# EAGLE design ps3-teensy-hid-v11 (EAGLE 5.09)
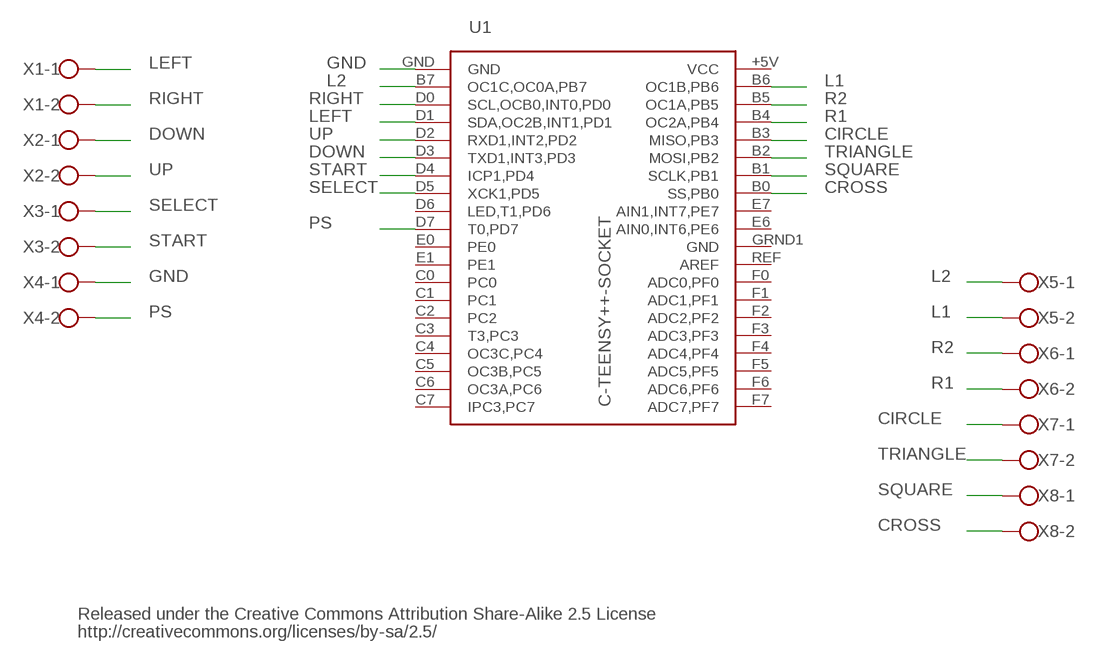
[diagram p0: schematic, sheet 1]

## Parts
U1  C-TEENSY++-SOCKET  [TEENSY++SOCKET]
X1  W237-102  [W237-102]
X2  W237-102  [W237-102]
X3  W237-102  [W237-102]
X4  W237-102  [W237-102]
X5  W237-102  [W237-102]
X6  W237-102  [W237-102]
X7  W237-102  [W237-102]
X8  W237-102  [W237-102]

## Nets
CIRCLE: U1.B3(MISO,PB3) X7.1
CROSS: U1.B0(SS,PB0) X8.2
DOWN: U1.D3(TXD1,INT3,PD3) X2.1
GND: U1.GND X4.1
L1: U1.B6(OC1B,PB6) X5.2
L2: U1.B7(OC1C,OC0A,PB7) X5.1
LEFT: U1.D1(SDA,OC2B,INT1,PD1) X1.1
PS: U1.D7(T0,PD7) X4.2
R1: U1.B4(OC2A,PB4) X6.2
R2: U1.B5(OC1A,PB5) X6.1
RIGHT: U1.D0(SCL,OCB0,INT0,PD0) X1.2
SELECT: U1.D5(XCK1,PD5) X3.1
SQUARE: U1.B1(SCLK,PB1) X8.1
START: U1.D4(ICP1,PD4) X3.2
TRIANGLE: U1.B2(MOSI,PB2) X7.2
UP: U1.D2(RXD1,INT2,PD2) X2.2
Unconnected: U1.C0 U1.C1 U1.C2 U1.C3(T3,PC3) U1.C4(OC3C,PC4) U1.C5(OC3B,PC5) U1.C6(OC3A,PC6) U1.C7(IPC3,PC7) U1.D6(LED,T1,PD6) U1.E0 U1.E1 U1.E6(AIN0,INT6,PE6) U1.E7(AIN1,INT7,PE7) U1.F0(ADC0,PF0) U1.F1(ADC1,PF1) U1.F2(ADC2,PF2) U1.F3(ADC3,PF3) U1.F4(ADC4,PF4) U1.F5(ADC5,PF5) U1.F6(ADC6,PF6) U1.F7(ADC7,PF7) U1.REF(AREF)

## Notes on the sheet
- Released under the Creative Commons Attribution Share-Alike 2.5 License
- http://creativecommons.org/licenses/by-sa/2.5/

## Power pins joined to a net without a drawn wire
GND: U1.GRND1(GND)
VCC: U1.+5V(VCC)

## Library data of the parts
U1 = teensypp:C-TEENSY++-SOCKET
X1-X8 = con-wago-500:W237-102: WAGO SCREW CLAMP

## Board
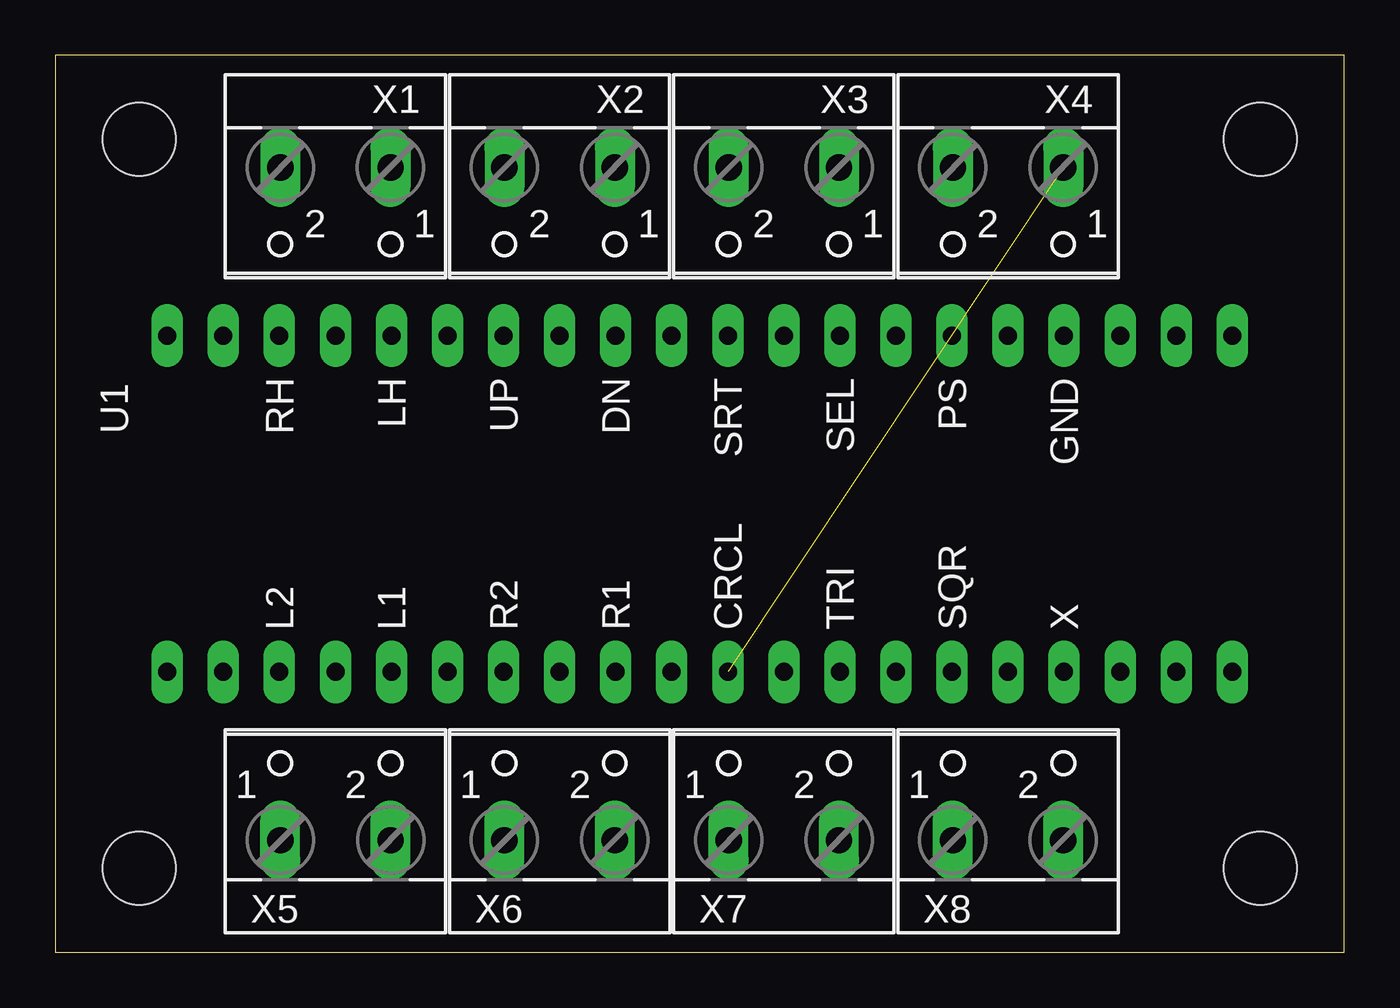
[diagram p1: board, top side]
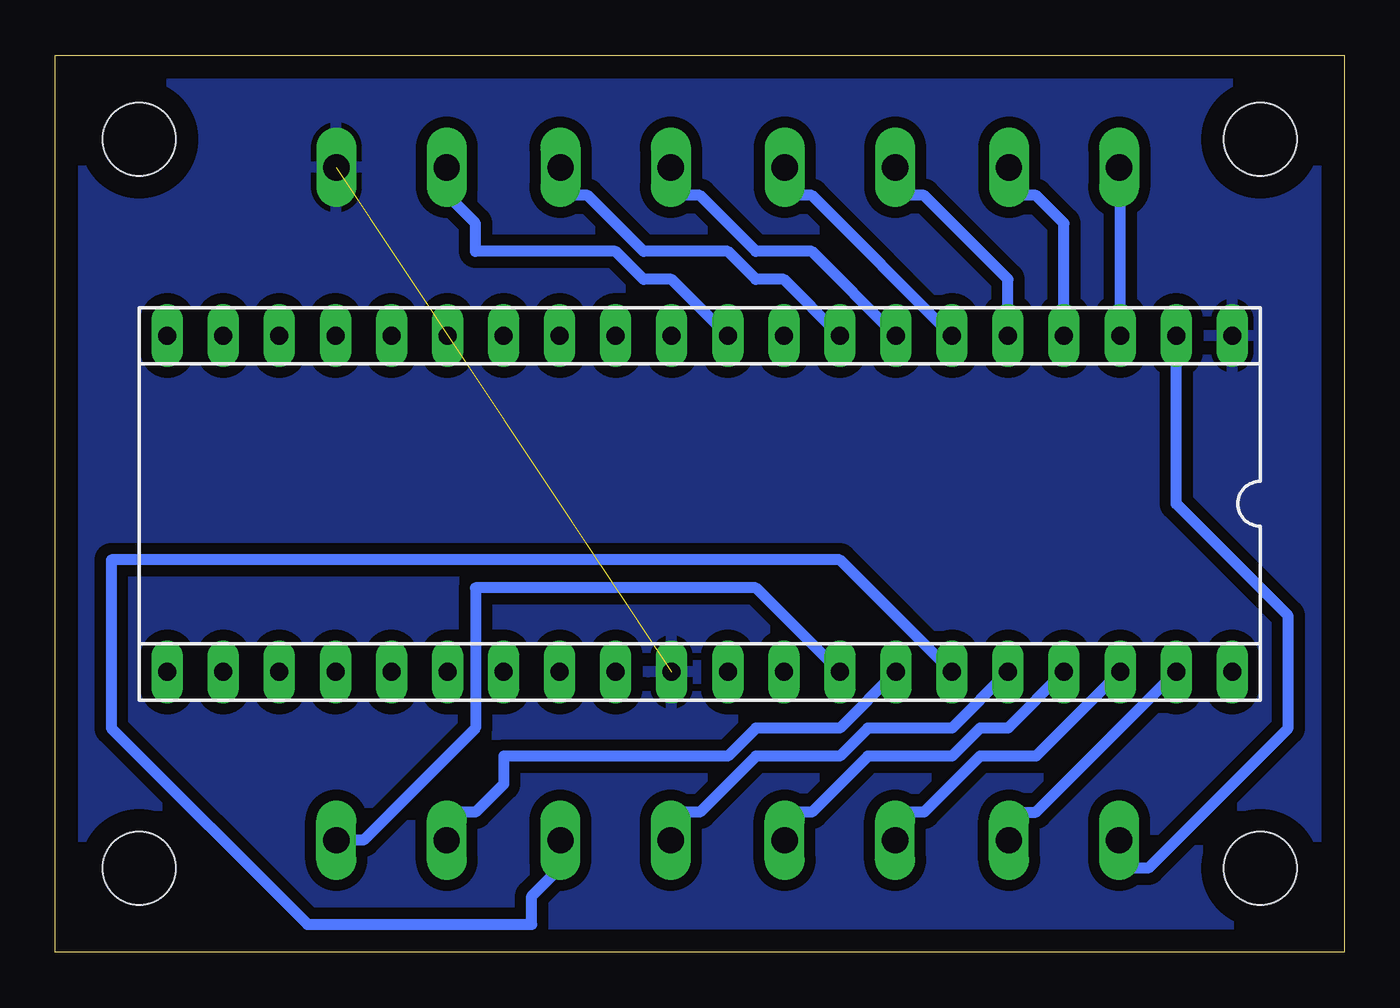
[diagram p2: board, bottom side, seen from below]

Size 58.42 x 40.64 mm. Coordinates in mm from the lower left corner, seen from the top.
Outline: 0,0 58.42,0 58.42,40.64 0,40.64 0,0
Copper layers (1*16): Top 0.035mm / dielectric 1.5mm / Bottom 0.035mm
Design rules "homebrew": minimum track width 20mil, minimum drill 24mil, track to track 8mil, track to pad 8mil, pad to pad 8mil, via to via 8mil, smd to smd 8mil, copper to edge 40mil, drill to drill 8mil, minimum pad ring 12mil, minimum via ring 8mil, stop-mask expansion 4mil, vias tented up to drill 0mil, thermal gap 10mil

### Footprints (pad centres in the part's own frame; a part is rotated, then mirrored left to right if it is on the bottom)
TEENSY++SOCKET = drill 0.813 long: +5V -22.86,7.62; B0 -5.08,7.62; B1 -7.62,7.62; B2 -10.16,7.62; B3 -12.7,7.62; B4 -15.24,7.62; B5 -17.78,7.62; B6 -20.32,7.62; B7 -20.32,-7.62; C0 7.62,-7.62; C1 10.16,-7.62; C2 12.7,-7.62; C3 15.24,-7.62; C4 17.78,-7.62; C5 20.32,-7.62; C6 22.86,-7.62; C7 25.4,-7.62; D0 -17.78,-7.62; D1 -15.24,-7.62; D2 -12.7,-7.62; D3 -10.16,-7.62; D4 -7.62,-7.62; D5 -5.08,-7.62; D6 -2.54,-7.62; D7 0,-7.62; E0 2.54,-7.62; E1 5.08,-7.62; E6 0,7.62; E7 -2.54,7.62; F0 7.62,7.62; F1 10.16,7.62; F2 12.7,7.62; F3 15.24,7.62; F4 17.78,7.62; F5 20.32,7.62; F6 22.86,7.62; F7 25.4,7.62; GND -22.86,-7.62; GRND1 2.54,7.62; REF 5.08,7.62
STAND-OFF = hole 3.302: 0,0
W237-102 = drill 1.194 long: 1 -2.5,-1.27; 2 2.5,-1.27

### Placement (x,y rotation side)
U1  27.94,20.32 180 bottom
U$1  [STAND-OFF]  3.81,3.81 0 top
U$2  [STAND-OFF]  3.81,36.83 0 top
U$3  [STAND-OFF]  54.61,36.83 0 top
U$4  [STAND-OFF]  54.61,3.81 0 top
X1  12.7,34.29 180 top
X2  22.86,34.29 180 top
X3  33.02,34.29 180 top
X4  43.18,34.29 180 top
X5  12.7,6.35 0 top
X6  22.86,6.35 0 top
X7  33.02,6.35 0 top
X8  43.18,6.35 0 top

### Tracks (layer width: path | path; a pad name or v marks a point on that pad's centre or on a via)
CIRCLE
  Bottom 0.508: U1.B3 17.78,10.16 21.59,10.16 22.86,8.89 26.67,8.89 29.21,6.35 30.48,6.35 30.48,5.08 X7.1
CROSS
  Bottom 0.508: U1.B0 26.67,16.51 39.37,16.51 39.37,10.16 44.45,5.08 X8.2 45.72,5.08
DOWN
  Bottom 0.508: U1.D3 24.13,34.29 25.4,34.29 25.4,35.56 X2.1
GND  (1 unrouted)
  pour Bottom (isolate 0.508): 1.27,39.37 57.15,39.37 57.15,1.27 1.27,1.27
L1
  Bottom 0.508: U1.B6 13.97,6.35 15.24,6.35 15.24,5.08 X5.2
L2
  Bottom 0.508: U1.B7 7.62,20.32 2.54,15.24 2.54,10.16 8.89,3.81 10.16,3.81 10.16,5.08 X5.1
LEFT
  Bottom 0.508: U1.D1 12.7,33.02 13.97,34.29 15.24,34.29 15.24,35.56 X1.1
PS
  Bottom 0.508: U1.D7 30.48,30.48 31.75,30.48 33.02,31.75 39.37,31.75 39.37,33.02 40.64,34.29 40.64,35.56 X4.2
R1
  Bottom 0.508: U1.B4 15.24,10.16 16.51,10.16 17.78,8.89 21.59,8.89 24.13,6.35 25.4,6.35 25.4,5.08 X6.2
R2
  Bottom 0.508: U1.B5 13.97,8.89 16.51,8.89 19.05,6.35 20.32,6.35 20.32,5.08 X6.1
RIGHT
  Bottom 0.508: U1.D0 10.16,35.56 X1.2
SELECT
  Bottom 0.508: U1.D5 25.4,30.48 26.67,30.48 27.94,31.75 31.75,31.75 34.29,34.29 35.56,34.29 35.56,35.56 X3.1
SQUARE
  Bottom 0.508: U1.B1 22.86,10.16 26.67,10.16 27.94,8.89 38.1,8.89 38.1,7.62 39.37,6.35 40.64,6.35 40.64,5.08 X8.1
START
  Bottom 0.508: U1.D4 24.13,31.75 26.67,31.75 29.21,34.29 30.48,34.29 30.48,35.56 X3.2
TRIANGLE
  Bottom 0.508: U1.B2 22.86,17.78 55.88,17.78 55.88,10.16 46.99,1.27 36.83,1.27 36.83,2.54 35.56,3.81 35.56,5.08 X7.2
UP
  Bottom 0.508: U1.D2 15.24,30.48 19.05,34.29 20.32,34.29 20.32,35.56 X2.2

### Text on the board
tPlace: RH | LH | UP | DN | SRT | SEL | PS | GND | L2 | L1 | R2 | R1 | CRCL | TRI | SQR | X
Document: Released under the Creative Commons Attribution Share-Alike 2.5 License | http://creativecommons.org/licenses/by-sa/2.5/